# Altium project Invertor_controller_v2.PrjPcb (part 1 of 3)
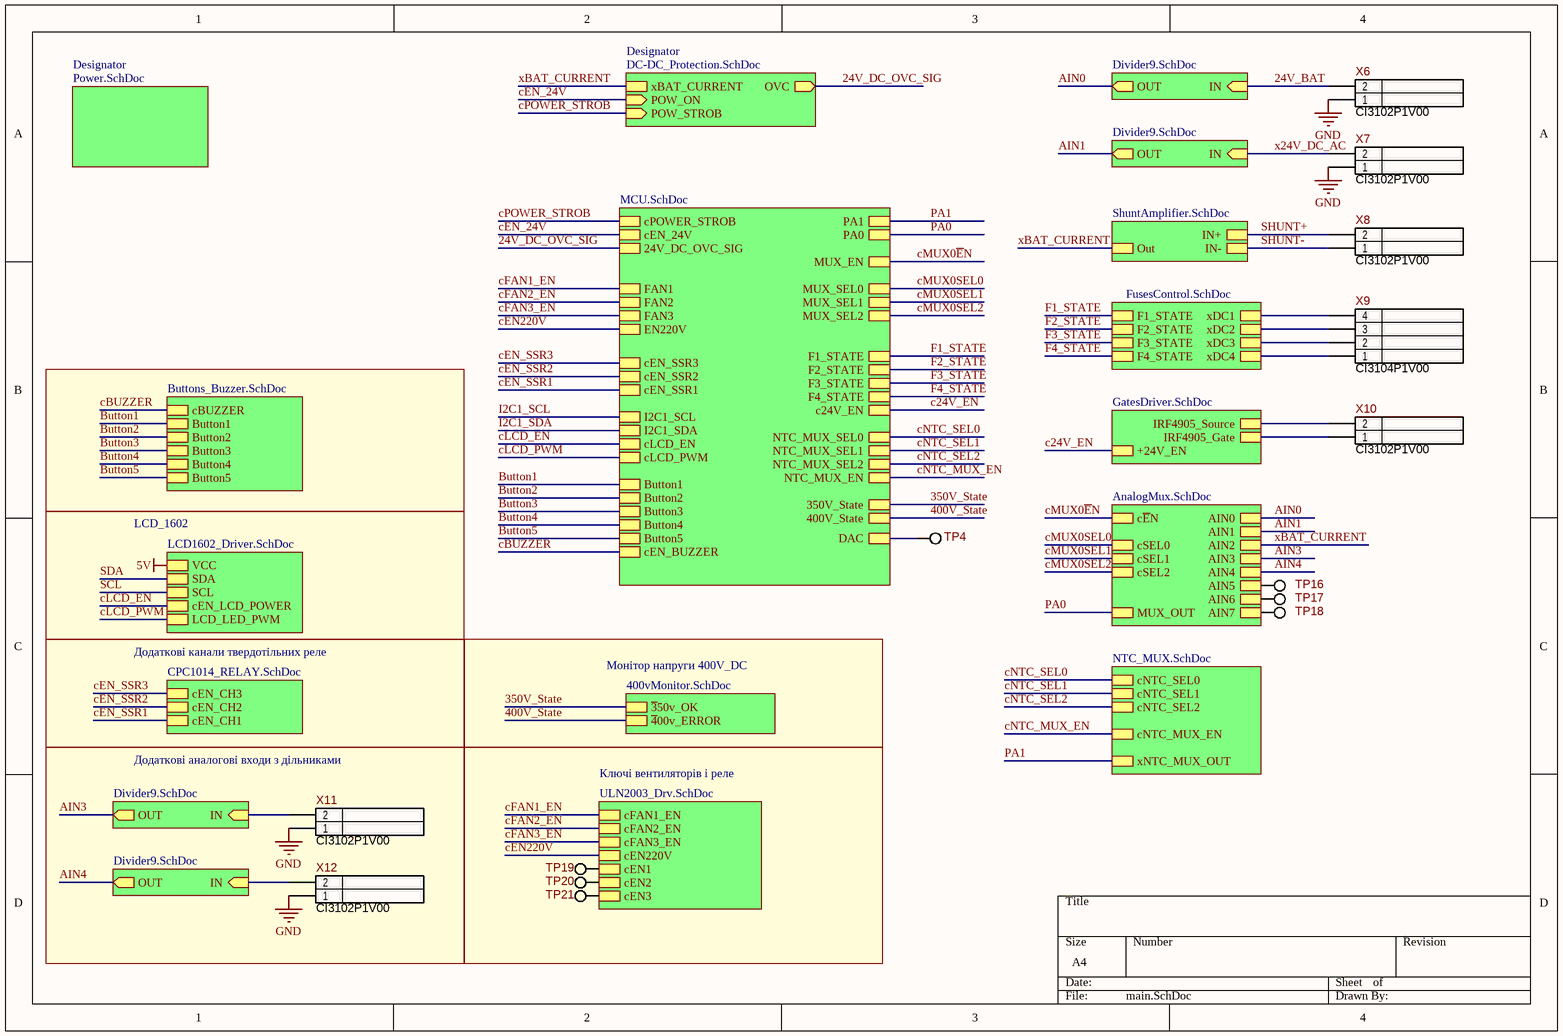
[diagram p0: main.SchDoc]
15 sheets, 254 parts. Net scope: hierarchical (ports join the sheet entries above them; power ports are global).
Board file: PCB1.PcbDoc
Sheets:
  main.SchDoc
    Designator = MCU.SchDoc
    Designator = AnalogMux.SchDoc
    Designator = Power.SchDoc
    Designator = Divider9.SchDoc
    Designator = Divider9.SchDoc
    Designator = ShuntAmplifier.SchDoc
    Designator = FusesControl.SchDoc
    Designator = GatesDriver.SchDoc
    Designator = NTC_MUX.SchDoc
      Designator = AnalogMux.SchDoc
    Designator = 400vMonitor.SchDoc
    Designator = DC-DC_Protection.SchDoc
    Designator = ULN2003_Drv.SchDoc
    Designator = Divider9.SchDoc
    Designator = Divider9.SchDoc
    Designator = CPC1014_RELAY.SchDoc
    Designator = LCD1602_Driver.SchDoc
    Designator = Buttons_Buzzer.SchDoc

## Sheet main.SchDoc
size A4

### Parts
TP4  PAD-1.1mm  [PAD-1.1mm]  (value not drawn)  (no BOM)
TP16  PAD-1.1mm  [PAD-1.1mm]  (value not drawn)  (no BOM)
TP17  PAD-1.1mm  [PAD-1.1mm]  (value not drawn)  (no BOM)
TP18  PAD-1.1mm  [PAD-1.1mm]  (value not drawn)  (no BOM)
TP19  PAD-1.1mm  [PAD-1.1mm]  (value not drawn)  (no BOM)
TP20  PAD-1.1mm  [PAD-1.1mm]  (value not drawn)  (no BOM)
TP21  PAD-1.1mm  [PAD-1.1mm]  (value not drawn)  (no BOM)
X6  WH-02S  [WF-2S]  (value not drawn)
X7  WH-02S  [WF-2S]  (value not drawn)
X8  WH-02S  [WF-2S]  (value not drawn)
X9  WH-04S  [WF-4S]  (value not drawn)
X10  WH-02S  [WF-2S]  (value not drawn)
X11  WH-02S  [WF-2S]  (value not drawn)
X12  WH-02S  [WF-2S]  (value not drawn)

### Blocks framed on the sheet
Додаткові аналогові входи з дільниками: X11 X12
Ключі вентиляторів і реле: TP19-TP21

### Sub-sheets
Designator = MCU.SchDoc: PA1, PA0, MUX_SEL0, MUX_SEL1, MUX_SEL2, MUX_EN, F3_STATE, F4_STATE, F2_STATE, F1_STATE, c24V_EN, NTC_MUX_SEL2, NTC_MUX_SEL0, NTC_MUX_SEL1, NTC_MUX_EN, 350V_State, 400V_State, cPOWER_STROB, cEN_24V, 24V_DC_OVC_SIG, FAN1, FAN3, EN220V, FAN2, cEN_SSR3, cEN_SSR1, cEN_SSR2, cLCD_EN, I2C1_SCL, cLCD_PWM, I2C1_SDA, Button3, Button5, Button1, Button2, cEN_BUZZER, Button4, DAC
Designator = AnalogMux.SchDoc: cSEL1, AIN7, AIN1, AIN0, MUX_OUT, AIN6, cSEL0, AIN4, AIN5, AIN3, AIN2, cSEL2, c~{E}N
Designator = Power.SchDoc: no entries
Designator = Divider9.SchDoc: OUT (out), IN (in)
Designator = Divider9.SchDoc: OUT (out), IN (in)
Designator = ShuntAmplifier.SchDoc: IN-, Out, IN+
Designator = FusesControl.SchDoc: xDC1, xDC3, xDC4, xDC2, F2_STATE, F3_STATE, F4_STATE, F1_STATE
Designator = GatesDriver.SchDoc: IRF4905_Source, +24V_EN, IRF4905_Gate
Designator = NTC_MUX.SchDoc: cNTC_SEL2, cNTC_SEL1, cNTC_SEL0, cNTC_MUX_EN, xNTC_MUX_OUT
Designator = 400vMonitor.SchDoc: ~{3}50v_OK, ~{4}00v_ERROR
Designator = DC-DC_Protection.SchDoc: OVC (out), POW_ON (in), xBAT_CURRENT, POW_STROB (in)
Designator = ULN2003_Drv.SchDoc: cFAN2_EN, cEN1, cEN220V, cEN3, cFAN1_EN, cFAN3_EN, cEN2
Designator = Divider9.SchDoc: OUT (out), IN (in)
Designator = Divider9.SchDoc: OUT (out), IN (in)
Designator = CPC1014_RELAY.SchDoc: cEN_CH3, cEN_CH2, cEN_CH1
Designator = LCD1602_Driver.SchDoc: SDA, SCL, cEN_LCD_POWER, LCD_LED_PWM, VCC
Designator = Buttons_Buzzer.SchDoc: cBUZZER, Button3, Button4, Button1, Button2, Button5

### Nets
GND: X6.1 X7.1 X11.1 X12.1
24V_BAT: X6.2 ; sheet Designator/IN
24V_DC_OVC_SIG: sheet Designator/24V_DC_OVC_SIG, sheet Designator/OVC
350V_State: sheet Designator/350V_State, sheet Designator/~{3}50v_OK
400V_State: sheet Designator/400V_State, sheet Designator/~{4}00v_ERROR
AIN0: sheet Designator/AIN0, sheet Designator/OUT
AIN1: sheet Designator/AIN1, sheet Designator/OUT
AIN3: sheet Designator/AIN3, sheet Designator/OUT
AIN4: sheet Designator/AIN4, sheet Designator/OUT
Button1: sheet Designator/Button1, sheet Designator/Button1
Button2: sheet Designator/Button2, sheet Designator/Button2
Button3: sheet Designator/Button3, sheet Designator/Button3
Button4: sheet Designator/Button4, sheet Designator/Button4
Button5: sheet Designator/Button5, sheet Designator/Button5
c24V_EN: sheet Designator/c24V_EN, sheet Designator/+24V_EN
cBUZZER: sheet Designator/cEN_BUZZER, sheet Designator/cBUZZER
cEN220V: sheet Designator/EN220V, sheet Designator/cEN220V
cEN_24V: sheet Designator/cEN_24V, sheet Designator/POW_ON
cEN_SSR1: sheet Designator/cEN_SSR1, sheet Designator/cEN_CH1
cEN_SSR2: sheet Designator/cEN_SSR2, sheet Designator/cEN_CH2
cEN_SSR3: sheet Designator/cEN_SSR3, sheet Designator/cEN_CH3
cFAN1_EN: sheet Designator/FAN1, sheet Designator/cFAN1_EN
cFAN2_EN: sheet Designator/FAN2, sheet Designator/cFAN2_EN
cFAN3_EN: sheet Designator/FAN3, sheet Designator/cFAN3_EN
cLCD_EN: sheet Designator/cLCD_EN, sheet Designator/cEN_LCD_POWER
cLCD_PWM: sheet Designator/cLCD_PWM, sheet Designator/LCD_LED_PWM
cMUX0~{E}N: sheet Designator/MUX_EN, sheet Designator/c~{E}N
cMUX0SEL0: sheet Designator/MUX_SEL0, sheet Designator/cSEL0
cMUX0SEL1: sheet Designator/MUX_SEL1, sheet Designator/cSEL1
cMUX0SEL2: sheet Designator/MUX_SEL2, sheet Designator/cSEL2
cNTC_MUX_EN: sheet Designator/NTC_MUX_EN, sheet Designator/cNTC_MUX_EN
cNTC_SEL0: sheet Designator/NTC_MUX_SEL0, sheet Designator/cNTC_SEL0
cNTC_SEL1: sheet Designator/NTC_MUX_SEL1, sheet Designator/cNTC_SEL1
cNTC_SEL2: sheet Designator/NTC_MUX_SEL2, sheet Designator/cNTC_SEL2
cPOWER_STROB: sheet Designator/cPOWER_STROB, sheet Designator/POW_STROB
F1_STATE: sheet Designator/F1_STATE, sheet Designator/F1_STATE
F2_STATE: sheet Designator/F2_STATE, sheet Designator/F2_STATE
F3_STATE: sheet Designator/F3_STATE, sheet Designator/F3_STATE
F4_STATE: sheet Designator/F4_STATE, sheet Designator/F4_STATE
PA0: sheet Designator/PA0, sheet Designator/MUX_OUT
PA1: sheet Designator/PA1, sheet Designator/xNTC_MUX_OUT
SHUNT+: X8.2 ; sheet Designator/IN+
SHUNT-: X8.1 ; sheet Designator/IN-
x24V_DC_AC: X7.2 ; sheet Designator/IN
xBAT_CURRENT: sheet Designator/AIN2, sheet Designator/Out, sheet Designator/xBAT_CURRENT
NetD6_2: X9.4 ; sheet Designator/xDC1
NetD7_2: X9.3 ; sheet Designator/xDC2
NetD8_2: X9.2 ; sheet Designator/xDC3
NetD9_2: X9.1 ; sheet Designator/xDC4
NetIC1_5: TP19.1 ; sheet Designator/cEN1
NetIC1_6: TP20.1 ; sheet Designator/cEN2
NetIC1_7: TP21.1 ; sheet Designator/cEN3
NetR12_Designator#3_1: X11.2 ; sheet Designator/IN
NetR12_Designator#4_1: X12.2 ; sheet Designator/IN
NetR25_2: X10.2 ; sheet Designator/IRF4905_Source
NetR26_1: X10.1 ; sheet Designator/IRF4905_Gate
NetTP4_1: TP4.1 ; sheet Designator/DAC
NetTP16_1: TP16.1 ; sheet Designator/AIN5
NetTP17_1: TP17.1 ; sheet Designator/AIN6
NetTP18_1: TP18.1 ; sheet Designator/AIN7

### Notes on the sheet
- LCD_1602
- Додаткові канали твердотільних реле
- Монітор напруги 400V_DC

### Library data of the parts
TP4 TP16-TP21 = PAD-1.1mm: 1.1mm Pad for Plug-In or Receptacle; Ajax_1C_PN: NONE; Ajax_1С_Status: RND Only; Component Status: Released; Lifecycle: ="Lifecycle"; Part Number: PAD-1.1mm; Component Type: PTH; Manufacturer: NONE; Part Type: Pad; Temperature Range: NONE; ComponentLink1URL: NONE; Replacement: NONE; Price: NONE; ComponentLink1Description: Datasheet
X6-X8 X10-X12 = CI3102P1V00: WH Series 2.54mm Wire to Board Straight DIP Type Headers, 2-Pin; Manufacturer: CviLux; Ajax_1C_PN: NONE; Part Number: CI3102P1V00; Part Type: Wire-to-Board; Component Type: PTH; Lifecycle: RND Only; Temperature Range: -25℃ ~ 85℃; ComponentLink1URL: https://www.cvilux.com/uploads/drawings/100/723/CI3102S.pdf; Replacement: NONE; ComponentLink1Description: Datasheet
X9 = CI3104P1V00: WH Series 2.54mm Wire to Board Straight DIP Type Headers, 4 Pin; Manufacturer: CviLux; Ajax_1C_ID: 1232; Ajax_1C_PN: WF-04S, разъем 4 пина "папа", на плату; Ajax_1С_Status: RND Only; Component Status: Released; Replacement: NONE; GUID_1C: 2c368b74-dd41-11e0-af93-6c626deda1bb; System: Connector; Part Number: CI3104P1V00; Part Type: Wire-to-Board / Header; Component Type: PTH; Temperature Range: -25℃ ~ 85℃; ComponentLink1URL: https://www.cvilux.com/uploads/drawings/100/723/CI3102S.pdf; Price: 0,06818182; ComponentLink1Description: Datasheet

## Sheet MCU.SchDoc
size A3
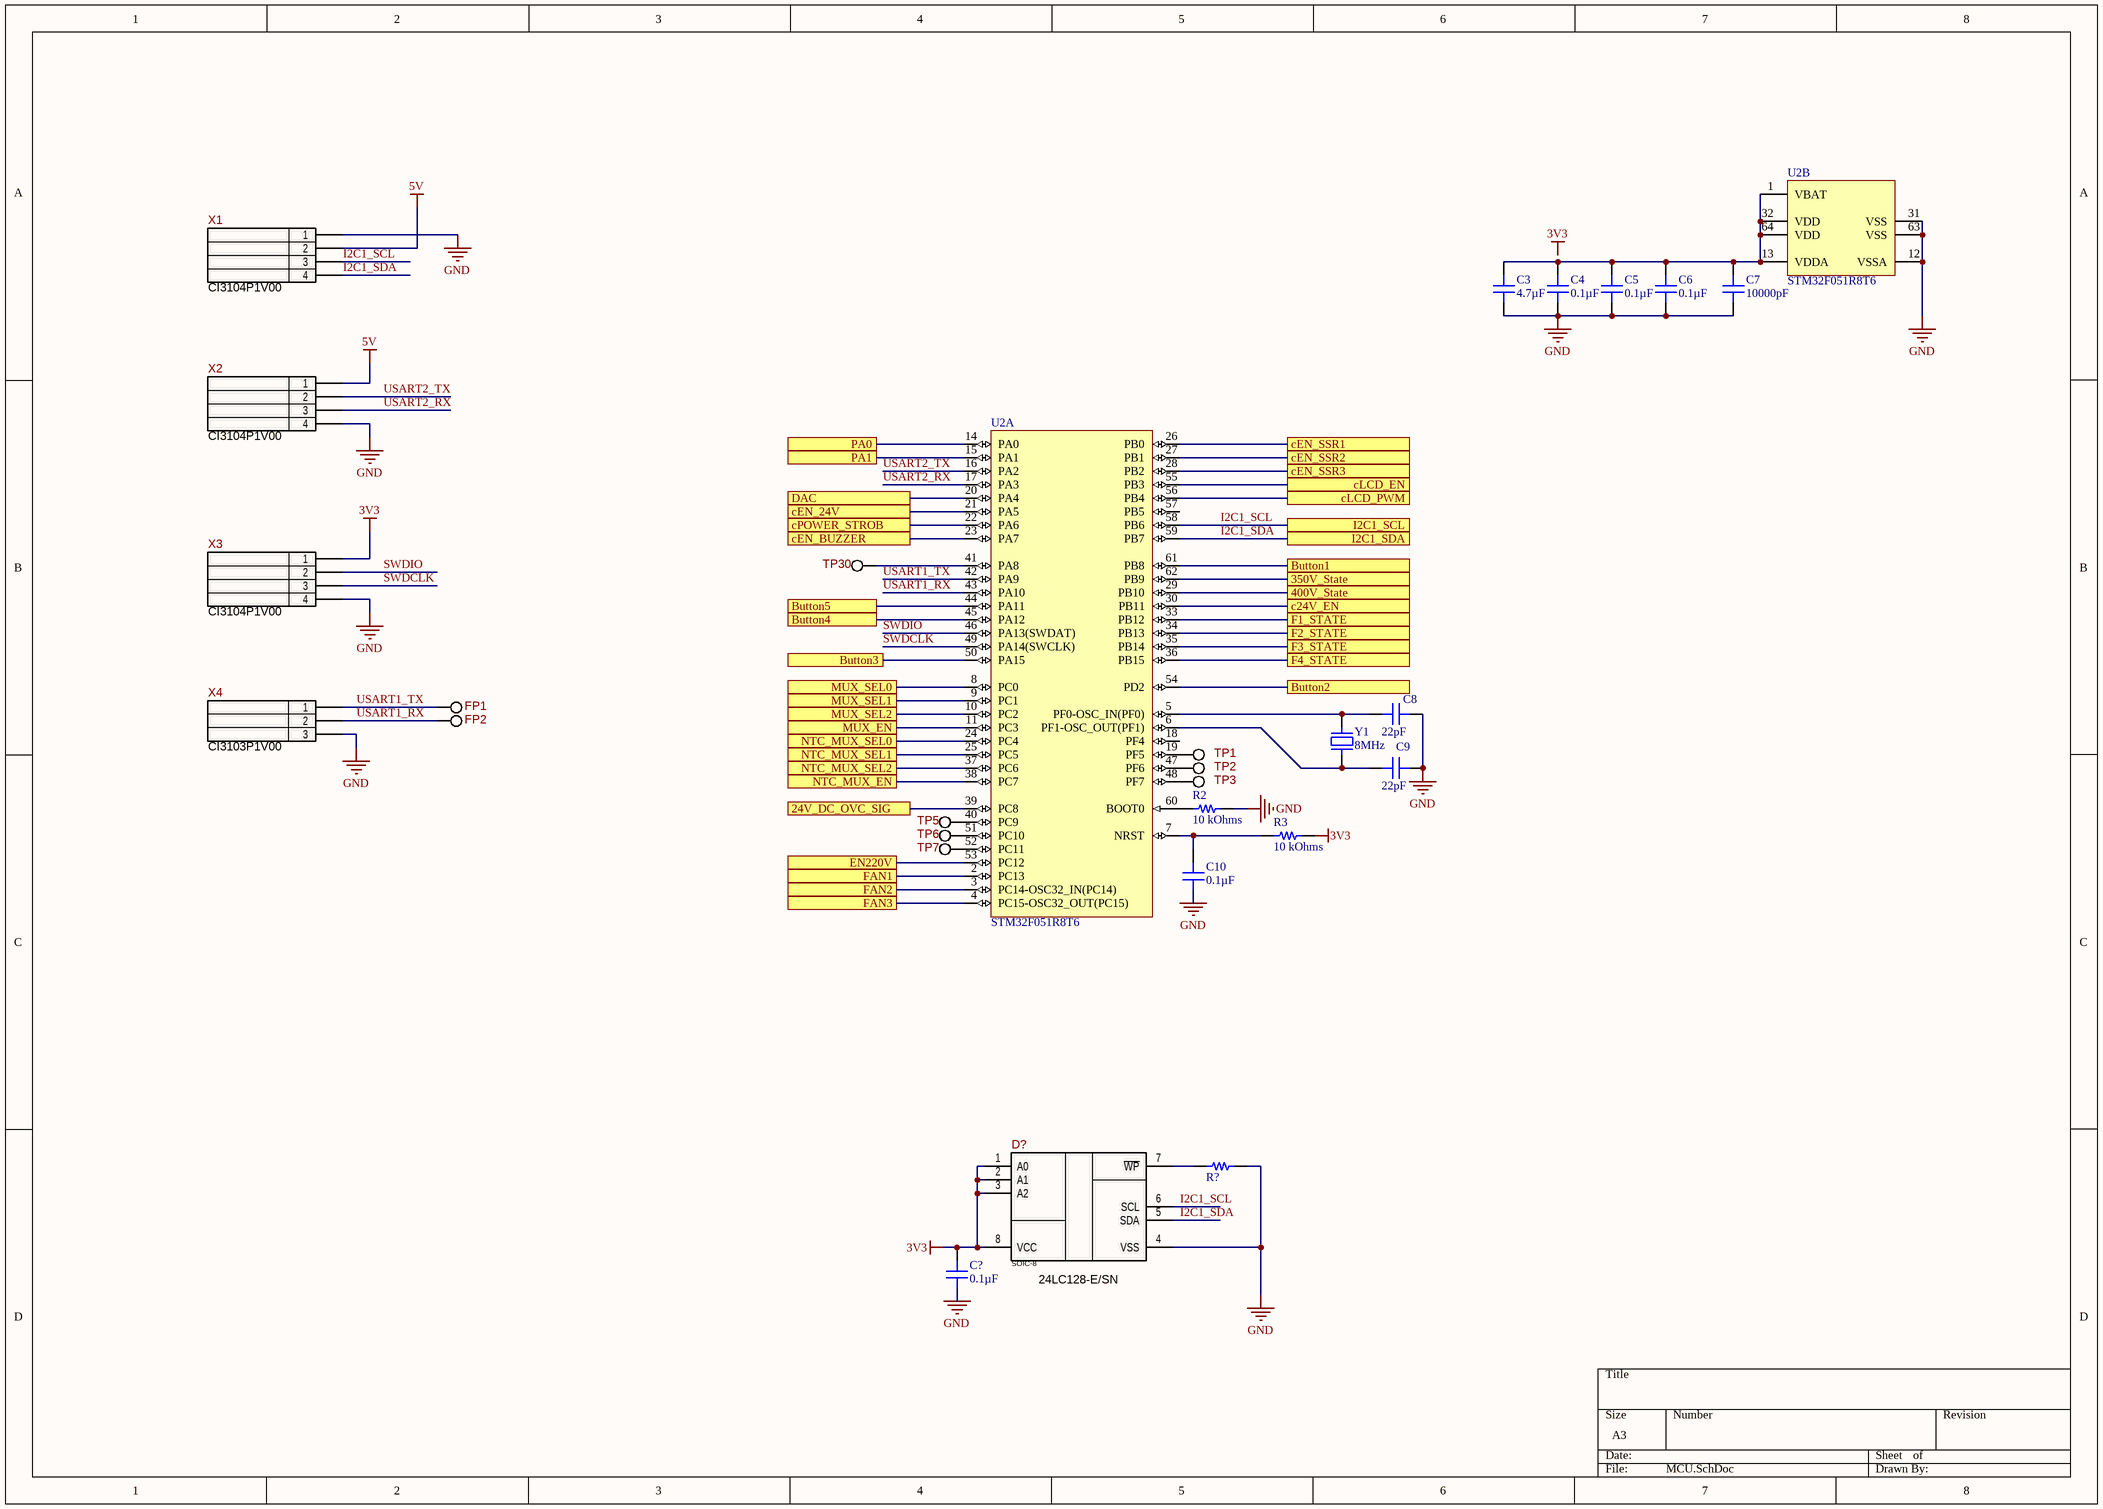
[diagram p1: MCU.SchDoc]

### Parts
C3  4.7µF  [CAP 0805_2012]
C4  0.1µF  [CAP 0805_2012]
C5  0.1µF  [CAP 0805_2012]
C6  0.1µF  [CAP 0805_2012]
C7  10000pF  [CAP 0805_2012]
C8  22pF  [CAP 0805_2012]
C9  22pF  [CAP 0805_2012]
C10  0.1µF  [CAP 0805_2012]
C?  0.1µF  [CAP 0805_2012]
D?  Package: SOIC-8  [SOIC-8_W3.9MM]  (hidden comment: 24LC128-E/SN)
FP1  PAD-1.1mm  [PAD-1.1mm]  (value not drawn)  (no BOM)
FP2  PAD-1.1mm  [PAD-1.1mm]  (value not drawn)  (no BOM)
R2  10 kOhms  [RES 0805_2012]
R3  10 kOhms  [RES 0805_2012]
R?  (no value)  [RES 0805_2012]
TP1  PAD-1.1mm  [PAD-1.1mm]  (value not drawn)  (no BOM)
TP2  PAD-1.1mm  [PAD-1.1mm]  (value not drawn)  (no BOM)
TP3  PAD-1.1mm  [PAD-1.1mm]  (value not drawn)  (no BOM)
TP5  PAD-1.1mm  [PAD-1.1mm]  (value not drawn)  (no BOM)
TP6  PAD-1.1mm  [PAD-1.1mm]  (value not drawn)  (no BOM)
TP7  PAD-1.1mm  [PAD-1.1mm]  (value not drawn)  (no BOM)
TP30  PAD-1.1mm  [PAD-1.1mm]  (value not drawn)  (no BOM)
U2  STM32F051R8T6  [STM-LQFP64_L]  (parts A,B of 2)
X1  WH-04S  [WF-4S]  (value not drawn)
X2  WH-04S  [WF-4S]  (value not drawn)
X3  WH-04S  [WF-4S]  (value not drawn)
X4  WH-03S  [WF-3S]  (value not drawn)
Y1  8MHz  [ABRACON ABLS]

### Ports
24V_DC_OVC_SIG, 350V_State, 400V_State, Button1, Button2, Button3, Button4, Button5, c24V_EN, cEN_24V, cEN_BUZZER, cEN_SSR1, cEN_SSR2, cEN_SSR3, cLCD_EN, cLCD_PWM, cPOWER_STROB, DAC, EN220V, F1_STATE, F2_STATE, F3_STATE, F4_STATE, FAN1, FAN2, FAN3, I2C1_SCL, I2C1_SDA, MUX_EN, MUX_SEL0, MUX_SEL1, MUX_SEL2, NTC_MUX_EN, NTC_MUX_SEL0, NTC_MUX_SEL1, NTC_MUX_SEL2, PA0, PA1

### Nets
3V3: C?.1 D?.1(A0) D?.2(A1) D?.3(A2) D?.8(VCC) R3.2 X3.1
5V: X1.2 X2.1  [project net PCF_VCC]
GND: C3.1 C4.1 C5.1 C6.1 C7.1 C8.2 C9.2 C10.1 C?.2 D?.4(VSS) R2.2 R?.2 U2.12(VSSA) U2.31(VSS) U2.63(VSS) X1.1 X2.4 X3.4 X4.3
24V_DC_OVC_SIG: U2.39(PC8) ; port 24V_DC_OVC_SIG
350V_State: U2.62(PB9) ; port 350V_State
400V_State: U2.29(PB10) ; port 400V_State
Button1: U2.61(PB8) ; port Button1
Button2: U2.54(PD2) ; port Button2
Button3: U2.50(PA15) ; port Button3
Button4: U2.45(PA12) ; port Button4
Button5: U2.44(PA11) ; port Button5
c24V_EN: U2.30(PB11) ; port c24V_EN
cBUZZER: U2.23(PA7) ; port cEN_BUZZER
cEN220V: U2.53(PC12) ; port EN220V
cEN_24V: U2.21(PA5) ; port cEN_24V
cEN_SSR1: U2.26(PB0) ; port cEN_SSR1
cEN_SSR2: U2.27(PB1) ; port cEN_SSR2
cEN_SSR3: U2.28(PB2) ; port cEN_SSR3
cFAN1_EN: U2.2(PC13) ; port FAN1
cFAN2_EN: U2.3(PC14-OSC32_IN(PC14)) ; port FAN2
cFAN3_EN: U2.4(PC15-OSC32_OUT(PC15)) ; port FAN3
cLCD_EN: U2.55(PB3) ; port cLCD_EN
cLCD_PWM: U2.56(PB4) ; port cLCD_PWM
cMUX0~{E}N: U2.11(PC3) ; port MUX_EN
cMUX0SEL0: U2.8(PC0) ; port MUX_SEL0
cMUX0SEL1: U2.9(PC1) ; port MUX_SEL1
cMUX0SEL2: U2.10(PC2) ; port MUX_SEL2
cNTC_MUX_EN: U2.38(PC7) ; port NTC_MUX_EN
cNTC_SEL0: U2.24(PC4) ; port NTC_MUX_SEL0
cNTC_SEL1: U2.25(PC5) ; port NTC_MUX_SEL1
cNTC_SEL2: U2.37(PC6) ; port NTC_MUX_SEL2
cPOWER_STROB: U2.22(PA6) ; port cPOWER_STROB
F1_STATE: U2.33(PB12) ; port F1_STATE
F2_STATE: U2.34(PB13) ; port F2_STATE
F3_STATE: U2.35(PB14) ; port F3_STATE
F4_STATE: U2.36(PB15) ; port F4_STATE
I2C1_SCL: D?.6(SCL) U2.58(PB6) X1.3 ; port I2C1_SCL
I2C1_SDA: D?.5(SDA) U2.59(PB7) X1.4 ; port I2C1_SDA
PA0: U2.14(PA0) ; port PA0
PA1: U2.15(PA1) ; port PA1
SWDCLK: U2.49(PA14(SWCLK)) X3.3
SWDIO: U2.46(PA13(SWDAT)) X3.2
USART1_RX: FP2.1 U2.43(PA10) X4.2
USART1_TX: FP1.1 U2.42(PA9) X4.1
USART2_RX: U2.17(PA3) X2.3
USART2_TX: U2.16(PA2) X2.2
NetC3_2: C3.2 C4.2 C5.2 C6.2 C7.2 U2.1(VBAT) U2.13(VDDA) U2.32(VDD) U2.64(VDD)
NetC8_1: C8.1 U2.5(PF0-OSC_IN(PF0)) Y1.2
NetC9_1: C9.1 U2.6(PF1-OSC_OUT(PF1)) Y1.1
NetC10_2: C10.2 R3.1 U2.7(NRST)
NetD?_7: D?.7(~{WP}) R?.1
NetR2_1: R2.1 U2.60(BOOT0)
NetTP1_1: TP1.1 U2.19(PF5)
NetTP2_1: TP2.1 U2.47(PF6)
NetTP3_1: TP3.1 U2.48(PF7)
NetTP4_1: U2.20(PA4) ; port DAC
NetTP5_1: TP5.1 U2.40(PC9)
NetTP6_1: TP6.1 U2.51(PC10)
NetTP7_1: TP7.1 U2.52(PC11)
NetTP30_1: TP30.1 U2.41(PA8)

Not connected (* = marked no-connect by the designer): U2 18(PF4) 57(PB5)

### Notes on the sheet
- Labels drawn without touching a wire or pin: 3V3

### Library data of the parts
C3 = CGA4J1X8L1C475K125AC: CAP CER X8L 16V 4.7UF 10% 1.25MM; Manufacturer: TDK Corporation; Part Number: CGA4J1X8L1C475K125AC; Value: 4.7µF; Applications: Automotive; Capacitance: 4.7µF; ComponentLink1Description: Datasheet; ComponentLink1URL: https://product.tdk.com/info/en/catalog/datasheets/mlcc_automotive_hightemp_en.pdf?ref_disty=digikey; ComponentLink2Description: DigiKey Link; ComponentLink2URL: http://digikey.com/product-detail/en/tdk-corporation/CGA4J1X8L1C475K125AC/445-175266-1-ND/7930961; Device Package: 0805 (2012 Metric); Features: High Temperature; LastUpdated: 02.09.2020 01:04:37; Lifecycle Status: Active; Minimum Order: 1; Mounting Type: Surface Mount, MLCC; Operating Temperature: -55°C ~ 150°C; Package / Case: 0805 (2012 Metric); Packaging: TapeAndReel; PartId: 5098; Part Status: Active; Price: 0.14; Ratings: AEC-Q200; Series: CGA; Size / Dimension: 0.079" L x 0.049" W (2.00mm x 1.25mm); Supplier 1: DigiKey; Supplier Part Number 1: 445-175266-1-ND; Temperature Coefficient: X8L; Thickness (Max): 0.057" (1.45mm); Tolerance: ±10%; Voltage - Rated: 16V
C4-C6 C10 C? = CC0805MRX7R9BB104: CAP CER 0.1UF 50V X7R 0805; Manufacturer: Yageo; Tolerance: ±20%; Part Number: CC0805MRX7R9BB104; Value: 0.1µF; Applications: General Purpose; Capacitance: 0.1µF; ComponentLink1Description: Datasheet; ComponentLink1URL: https://www.yageo.com/upload/media/product/productsearch/datasheet/mlcc/UPY-GPHC_X7R_6.3V-to-50V_18.pdf; ComponentLink2Description: DigiKey Link; ComponentLink2URL: http://digikey.com/product-detail/en/yageo/CC0805MRX7R9BB104/311-4351-1-ND/8025440; Device Package: 0805 (2012 Metric); LastUpdated: 02.09.2020 01:04:42; Lifecycle Status: Active; Minimum Order: 1; Mounting Type: Surface Mount, MLCC; Operating Temperature: -55°C ~ 125°C; Package / Case: 0805 (2012 Metric); Packaging: TapeAndReel; PartId: 2475; Part Status: Active; Price: 0.02; Series: CC; Size / Dimension: 0.079" L x 0.049" W (2.00mm x 1.25mm); Supplier 1: DigiKey; Supplier Part Number 1: 311-4351-1-ND; Temperature Coefficient: X7R; Thickness (Max): 0.037" (0.95mm); Voltage - Rated: 50V
C7 = C0805C103K5RECAUTO: CAP CER 0805 10NF 50V X7R 10%; Manufacturer: KEMET; Part Number: C0805C103K5RECAUTO; Value: 10000pF; Applications: Automotive, ESD Protection; Capacitance: 10000pF; ComponentLink1Description: Datasheet; ComponentLink1URL: https://api.kemet.com/component-edge/download/datasheet/C0805C103K5RECAUTO.pdf; ComponentLink2Description: DigiKey Link; ComponentLink2URL: http://digikey.com/product-detail/en/kemet/C0805C103K5RECAUTO/399-17885-1-ND/8640552; Device Package: 0805 (2012 Metric); LastUpdated: 02.09.2020 01:04:31; Lifecycle Status: Active; Minimum Order: 1; Mounting Type: Surface Mount, MLCC; Operating Temperature: -55°C ~ 125°C; Package / Case: 0805 (2012 Metric); Packaging: TapeAndReel; PartId: 8498; Part Status: Active; Price: 0.05; Ratings: AEC-Q200; Series: ESD SMD Auto X7R; Size / Dimension: 0.079" L x 0.049" W (2.00mm x 1.25mm); Supplier 1: DigiKey; Supplier Part Number 1: 399-17885-1-ND; Temperature Coefficient: X7R; Thickness (Max): 0.035" (0.88mm); Tolerance: ±10%; Voltage - Rated: 50V
C8 C9 = C0805C220J5GACAUTO: CAP CER 22PF 50V C0G/NP0 0805; Manufacturer: KEMET; Temperature Coefficient: C0G, NP0; Tolerance: ±5%; Part Number: C0805C220J5GACAUTO; Value: 22pF; Applications: Automotive; Capacitance: 22pF; ComponentLink1Description: Datasheet; ComponentLink1URL: https://api.kemet.com/component-edge/download/datasheet/C0805C220J5GACAUTO.pdf; ComponentLink2Description: DigiKey Link; ComponentLink2URL: http://digikey.com/product-detail/en/kemet/C0805C220J5GACAUTO/399-6937-1-ND/3314446; Device Package: 0805 (2012 Metric); Features: Low ESL; LastUpdated: 02.09.2020 01:04:42; Lifecycle Status: Active; Minimum Order: 1; Mounting Type: Surface Mount, MLCC; Operating Temperature: -55°C ~ 125°C; Package / Case: 0805 (2012 Metric); Packaging: TapeAndReel; PartId: 2537; Part Status: Active; Price: 0.02; Ratings: AEC-Q200; Series: SMD Auto C0G; Size / Dimension: 0.079" L x 0.049" W (2.00mm x 1.25mm); Supplier 1: DigiKey; Supplier Part Number 1: 399-6937-1-ND; Thickness (Max): 0.035" (0.88mm); Voltage - Rated: 50V
D? = 24LC128-E/SN: EEPROM Memory IC 128Kb (16K x 8) I2C 400kHz 900ns SOIC-8; Manufacturer: Microchip Technology; Ajax_1C_ID: 10590; Ajax_1C_PN: 24LC128-E/SN SO8; Ajax_1С_Status: RND Only; Standard Lead Time: 6 Weeks; Component Status: On Review; Replacement: NONE; GUID_1C: 19c1e12f-7c36-11e7-813c-14dda9d2d04d; Part Type: Memory / EEPROM; Component Type: SMD; Temperature Range: -40°C ~ 125°C; ComponentLink1URL: http://www.microchip.com/mymicrochip/filehandler.aspx?ddocname=en011851; Supplier 1: Mouser; Supplier Part Number 1: 579-24LC128-E/SN; Price: 0,94; ComponentLink1Description: Datasheet; Part Number: 24LC128-E/SN
FP1 FP2 = PAD-1.1mm: 1.1mm Pad for Plug-In or Receptacle; Ajax_1C_PN: NONE; Part Number: PAD-1.1mm; Component Type: PTH; Lifecycle: RND Only; Manufacturer: NONE; Part Type: Pad; Temperature Range: NONE; ComponentLink1URL: NONE; Replacement: NONE; ComponentLink1Description: Datasheet
R2 R3 = RNCS0805BKE10K0: RES 10K OHM 0.1% 1/10W 0805; Manufacturer: Stackpole Electronics Inc; Power (Watts): 0.1W, 1/10W; Temperature Coefficient: ±25ppm/°C; Part Number: RNCS0805BKE10K0; Value: 10 kOhms; ComponentLink1Description: Datasheet; ComponentLink1URL: https://www.seielect.com/catalog/sei-rncs_rnch.pdf; ComponentLink2Description: DigiKey Link; ComponentLink2URL: http://digikey.com/product-detail/en/stackpole-electronics-inc/RNCS0805BKE10K0/RNCS0805BKE10K0CT-ND/1800164; Composition: Thin Film; Device Package: 0805 (2012 Metric); Features: Anti-Corrosive, Automotive AEC-Q200, Moisture Resistant; Height - Seated (Max): 0.026" (0.65mm); LastUpdated: 02.09.2020 01:15:24; Lifecycle Status: Active; Minimum Order: 1; Number of Terminations: 2; Operating Temperature: -55°C ~ 155°C; Package / Case: 0805 (2012 Metric); Packaging: TapeAndReel; PartId: 27713; Part Status: Active; Price: 0.09; Ratings: AEC-Q200; Resistance: 10 kOhms; Series: RNCS; Size / Dimension: 0.079" L x 0.049" W (2.00mm x 1.25mm); Supplier 1: DigiKey; Supplier Part Number 1: RNCS0805BKE10K0CT-ND; Supplier Device Package: 0805; Tolerance: ±0.1%
R? = TLRZ2ATTD: RES 0 OHM JUMPER 0805; Manufacturer: KOA Speer Electronics, Inc.; Part Number: TLRZ2ATTD; ComponentLink1Description: Datasheet; ComponentLink1URL: http://www.koaspeer.com/catimages/Products/TLRZ/TLRZ.pdf; ComponentLink2Description: DigiKey Link; ComponentLink2URL: http://digikey.com/product-detail/en/koa-speer-electronics-inc/TLRZ2ATTD/2019-TLRZ2ATTDCT-ND/9847538; Composition: Metal Element; Device Package: 0805 (2012 Metric); Features: Automotive AEC-Q200, Current Sense; Height - Seated (Max): 0.022" (0.55mm); LastUpdated: 02.09.2020 01:15:24; Lifecycle Status: Active; Minimum Order: 1; Number of Terminations: 2; Operating Temperature: -55°C ~ 170°C; Package / Case: 0805 (2012 Metric); Packaging: TapeAndReel; PartId: 27685; Part Status: Active; Price: 0.09; Ratings: AEC-Q200; Series: TLRZ; Size / Dimension: 0.079" L x 0.049" W (2.00mm x 1.25mm); Supplier 1: DigiKey; Supplier Part Number 1: 2019-TLRZ2ATTDCT-ND; Supplier Device Package: 0805; Tolerance: Jumper
TP1-TP3 TP5-TP7 TP30 = PAD-1.1mm: as TP4 on sheet main; Lifecycle: ="Lifecycle"; Part Number: PAD-1.1mm; Component Type: PTH; Manufacturer: NONE; Part Type: Pad; Temperature Range: NONE; ComponentLink1URL: NONE; Replacement: NONE; Price: NONE; ComponentLink1Description: Datasheet
U2 = STM32F051R8T6: ARM Cortex-M0 32-bit MCU, 64 KB Flash, 8 KB Internal RAM, 55 I/Os, 64-pin LQFP, -40 to 85 degC, Tray; FLASH Size (Prog) (kB): 64; I/Os (High Current): 55; Internal RAM Size (kB): 8; Operating Frequency(F) (Processor speed) (MHz): 48; Supply Voltage(Vcc) min (V): 2; DatasheetVersion: Rev. 3; PackageVersion: Rev. 4, 06/2013; PackageReference: LQFP64; PackageDescription: 64-Pin Low Profile Quad Flat Package, 10 x 10 mm Body, 0.5 mm Pitch; Supplier 1: Digi-Key; Supplier Part Number 1: 497-12891-ND; Supplier 2: Farnell; Supplier Part Number 2: 2115071; Supplier 3: Newark; Supplier Part Number 3: 05W5808; Supplier 4: Mouser; Supplier Part Number 4: 511-STM32F051R8T6; Core: ARM Cortex-M0; Packing: Tray; Mounting Technology: Surface Mount; PartNumber: STM32F051R8T6; ComponentLink1Description: Manufacturer URL; ComponentLink1URL: http://www.st.com/web/en/home.html; ComponentLink2Description: Datasheet; ComponentLink2URL: http://www.st.com/st-web-ui/static/active/en/resource/technical/document/datasheet/DM00039193.pdf; ComponentLink3Description: Package Specification; ComponentLink3URL: http://www.st.com/st-web-ui/static/active/en/resource/technical/document/datasheet/DM00037051.pdf
X1-X3 = CI3104P1V00: as X9 on sheet main; Part Number: CI3104P1V00; Part Type: Wire-to-Board / Header; Component Type: PTH; Temperature Range: -25℃ ~ 85℃; ComponentLink1URL: https://www.cvilux.com/uploads/drawings/100/723/CI3102S.pdf; Price: 0,06818182; ComponentLink1Description: Datasheet
X4 = CI3103P1V00: WH Series 2.54mm Wire to Board Straight DIP Type Headers, 3-Pin; Manufacturer: CviLux; Ajax_1C_ID: 6819; Ajax_1C_PN: WF-03S (KLS1-2.54-03S); Штекер "папа"; 3 контакта; шаг 2.54мм; прямой; на плату; Ajax_1С_Status: RND Only; Component Status: Released; Replacement: NONE; GUID_1C: c0930565-35d6-11e5-ad28-a45d36c4a9e5; System: Connector; Part Number: CI3103P1V00; Part Type: Wire-to-Board / Header; Component Type: PTH; Temperature Range: -25℃ ~ 85℃; ComponentLink1URL: https://www.cvilux.com/uploads/drawings/100/723/CI3102S.pdf; Price: 0,016; ComponentLink1Description: Datasheet
Y1 = ABLS-8.000MHZ-SD7Y-T: CRYSTAL 8.000MHZ 18PF SMD; Manufacturer: Abracon LLC; ESR (Equivalent Series Resistance): 80 Ohms; Frequency Stability: ±30ppm; Frequency Tolerance: ±15ppm; Operating Mode: Fundamental; Part Number: ABLS-8.000MHZ-SD7Y-T; ComponentLink1Description: Datasheet; ComponentLink1URL: https://abracon.com/Resonators/abls.pdf; ComponentLink2Description: DigiKey Link; ComponentLink2URL: http://digikey.com/product-detail/en/abracon-llc/ABLS-8.000MHZ-SD7Y-T/535-14365-1-ND/8582126; Frequency: 8MHz; Height - Seated (Max): 0.165" (4.20mm); LastUpdated: 02.09.2020 01:21:46; Lifecycle Status: Active; Load Capacitance: 18pF; Minimum Order: 1; Mounting Type: Surface Mount; Operating Temperature: -40°C ~ 85°C; Package / Case: HC-49/US; Packaging: TapeAndReel; PartId: 25; Part Status: Active; Price: 0.24; Series: ABLS; Size / Dimension: 0.449" L x 0.185" W (11.40mm x 4.70mm); Supplier 1: DigiKey; Supplier Part Number 1: 535-14365-1-ND; Type: MHz Crystal; Value: 8MHz

## Sheet AnalogMux.SchDoc
size A4
Used 2 times, as channels Designator, Designator/Designator. Parts and nets are listed once, with the designators drawn on the sheet.
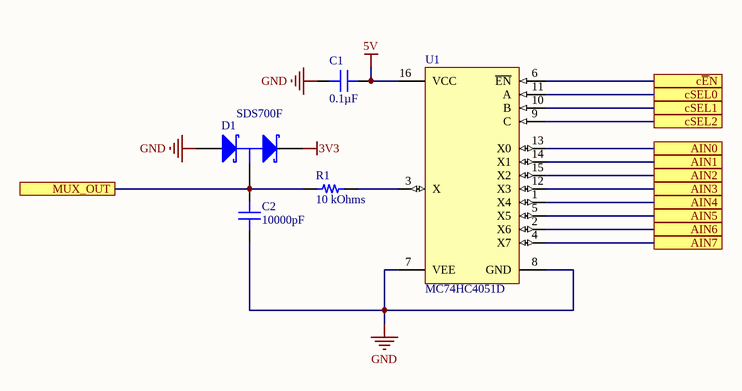
[diagram p2: AnalogMux.SchDoc]

### Parts
C1  0.1µF  [CAP 0805_2012]
C2  10000pF  [CAP 0805_2012]
D1  SDS700F  [SOT323_N]
R1  10 kOhms  [RES 0805_2012]
U1  MC74HC4051D  [751B-05_N]

### Ports
AIN0, AIN1, AIN2, AIN3, AIN4, AIN5, AIN6, AIN7, cSEL0, cSEL1, cSEL2, c~{E}N, MUX_OUT

### Nets
3V3: D1.2(K)
5V: C1.1 U1.16(VCC)
GND: C1.2 C2.1 D1.1(A) U1.7(VEE) U1.8(GND)
AIN0: U1.13(X0) ; port AIN0
AIN1: U1.14(X1) ; port AIN1
AIN2: U1.15(X2) ; port AIN2
AIN3: U1.12(X3) ; port AIN3
AIN4: U1.1(X4) ; port AIN4
AIN5: U1.5(X5) ; port AIN5
AIN6: U1.2(X6) ; port AIN6
AIN7: U1.4(X7) ; port AIN7
c~{E}N: U1.6(~{EN}) ; port c~{E}N
cSEL0: U1.11(A) ; port cSEL0
cSEL1: U1.10(B) ; port cSEL1
cSEL2: U1.9(C) ; port cSEL2
MUX_OUT: C2.2 D1.3(C) R1.1 ; port MUX_OUT
NetR1_2: R1.2 U1.3(X)

### Channels
Designator: designators end in _Designator; ports AIN0=AIN0 AIN1=AIN1 AIN2=xBAT_CURRENT AIN3=AIN3 AIN4=AIN4 AIN5=NetTP16_1 AIN6=NetTP17_1 AIN7=NetTP18_1 cSEL0=cMUX0SEL0 cSEL1=cMUX0SEL1 cSEL2=cMUX0SEL2 c~{E}N=cMUX0~{E}N MUX_OUT=PA0
Designator/Designator: designators end in _Designator_Designator; ports AIN0=NetJ1_1 AIN1=NetJ2_1 AIN2=NetJ3_1 AIN3=NetJ4_1 AIN4=NetJ5_1 AIN5=NetJ6_1 AIN6=NetJ8_1 AIN7=NetJ7_1 cSEL0=cNTC_SEL0 cSEL1=cNTC_SEL1 cSEL2=cNTC_SEL2 c~{E}N=cNTC_MUX_EN MUX_OUT=PA1

### Library data of the parts
C1 = CC0805MRX7R9BB104: as C4 on sheet MCU; Part Number: CC0805MRX7R9BB104; Value: 0.1µF; Applications: General Purpose; Capacitance: 0.1µF; ComponentLink1Description: Datasheet; ComponentLink1URL: https://www.yageo.com/upload/media/product/productsearch/datasheet/mlcc/UPY-GPHC_X7R_6.3V-to-50V_18.pdf; ComponentLink2Description: DigiKey Link; ComponentLink2URL: http://digikey.com/product-detail/en/yageo/CC0805MRX7R9BB104/311-4351-1-ND/8025440; Device Package: 0805 (2012 Metric); LastUpdated: 02.09.2020 01:04:42; Lifecycle Status: Active; Minimum Order: 1; Mounting Type: Surface Mount, MLCC; Operating Temperature: -55°C ~ 125°C; Package / Case: 0805 (2012 Metric); Packaging: TapeAndReel; PartId: 2475; Part Status: Active; Price: 0.02; Series: CC; Size / Dimension: 0.079" L x 0.049" W (2.00mm x 1.25mm); Supplier 1: DigiKey; Supplier Part Number 1: 311-4351-1-ND; Temperature Coefficient: X7R; Thickness (Max): 0.037" (0.95mm); Voltage - Rated: 50V
C2 = C0805C103K5RECAUTO: as C7 on sheet MCU; Part Number: C0805C103K5RECAUTO; Value: 10000pF; Applications: Automotive, ESD Protection; Capacitance: 10000pF; ComponentLink1Description: Datasheet; ComponentLink1URL: https://api.kemet.com/component-edge/download/datasheet/C0805C103K5RECAUTO.pdf; ComponentLink2Description: DigiKey Link; ComponentLink2URL: http://digikey.com/product-detail/en/kemet/C0805C103K5RECAUTO/399-17885-1-ND/8640552; Device Package: 0805 (2012 Metric); LastUpdated: 02.09.2020 01:04:31; Lifecycle Status: Active; Minimum Order: 1; Mounting Type: Surface Mount, MLCC; Operating Temperature: -55°C ~ 125°C; Package / Case: 0805 (2012 Metric); Packaging: TapeAndReel; PartId: 8498; Part Status: Active; Price: 0.05; Ratings: AEC-Q200; Series: ESD SMD Auto X7R; Size / Dimension: 0.079" L x 0.049" W (2.00mm x 1.25mm); Supplier 1: DigiKey; Supplier Part Number 1: 399-17885-1-ND; Temperature Coefficient: X7R; Thickness (Max): 0.035" (0.88mm); Tolerance: ±10%; Voltage - Rated: 50V
D1 = BAT854SW: Schottky Barrier Double Diode; Published: 17-Sep-2003; LatestRevisionDate: 12-Dec-2006; LatestRevisionNote: IPC-7351 Footprint Added.; DatasheetVersion: 27-Feb-2001; PackageVersion: Apr-1999; PackageReference: SOT323; Publisher: Altium Limited; PackageDescription: 3-Pin SOT-323 Package 0.65 mm Pitch, 2.1 mm Lead Span; ComponentLink1Description: Manufacturer Link; ComponentLink1URL: http://www.semiconductors.philips.com/; ComponentLink2Description: Datasheet; ComponentLink2URL: http://www.semiconductors.philips.com/acrobat/datasheets/BAT854W_SERIES_1.pdf
R1 = RNCS0805BKE10K0: as R2 on sheet MCU; Part Number: RNCS0805BKE10K0; Value: 10 kOhms; ComponentLink1Description: Datasheet; ComponentLink1URL: https://www.seielect.com/catalog/sei-rncs_rnch.pdf; ComponentLink2Description: DigiKey Link; ComponentLink2URL: http://digikey.com/product-detail/en/stackpole-electronics-inc/RNCS0805BKE10K0/RNCS0805BKE10K0CT-ND/1800164; Composition: Thin Film; Device Package: 0805 (2012 Metric); Features: Anti-Corrosive, Automotive AEC-Q200, Moisture Resistant; Height - Seated (Max): 0.026" (0.65mm); LastUpdated: 02.09.2020 01:15:24; Lifecycle Status: Active; Minimum Order: 1; Number of Terminations: 2; Operating Temperature: -55°C ~ 155°C; Package / Case: 0805 (2012 Metric); Packaging: TapeAndReel; PartId: 27713; Part Status: Active; Price: 0.09; Ratings: AEC-Q200; Resistance: 10 kOhms; Series: RNCS; Size / Dimension: 0.079" L x 0.049" W (2.00mm x 1.25mm); Supplier 1: DigiKey; Supplier Part Number 1: RNCS0805BKE10K0CT-ND; Supplier Device Package: 0805; Tolerance: ±0.1%
U1 = MC74HC4051D: 8-Channel Analog Multiplexer/Demultiplexer; Published: 15-Apr-2002; LatestRevisionDate: 13-Apr-2006; LatestRevisionNote: IPC-7351 Footprint Added.; DatasheetVersion: 1995; PackageVersion: Oct-1999; PackageReference: 751B-05; Publisher: Altium Limited; PackageDescription: 16-Pin Small Outline Integrated Circuit 1.27 mm Pitch; Code_JEDEC: MS-012-AC; Code_IPC: SOIC127P600-16; ComponentLink1Description: Manufacturer Link; ComponentLink1URL: http://www.onsemi.com/; ComponentLink2Description: Datasheet; ComponentLink2URL: http://www.onsemi.com/pub/Collateral/MC74HC4051-D.PDF